# EAGLE design SparkFun_Mega_Pro_Mini-3.3V (EAGLE 7.2.0)
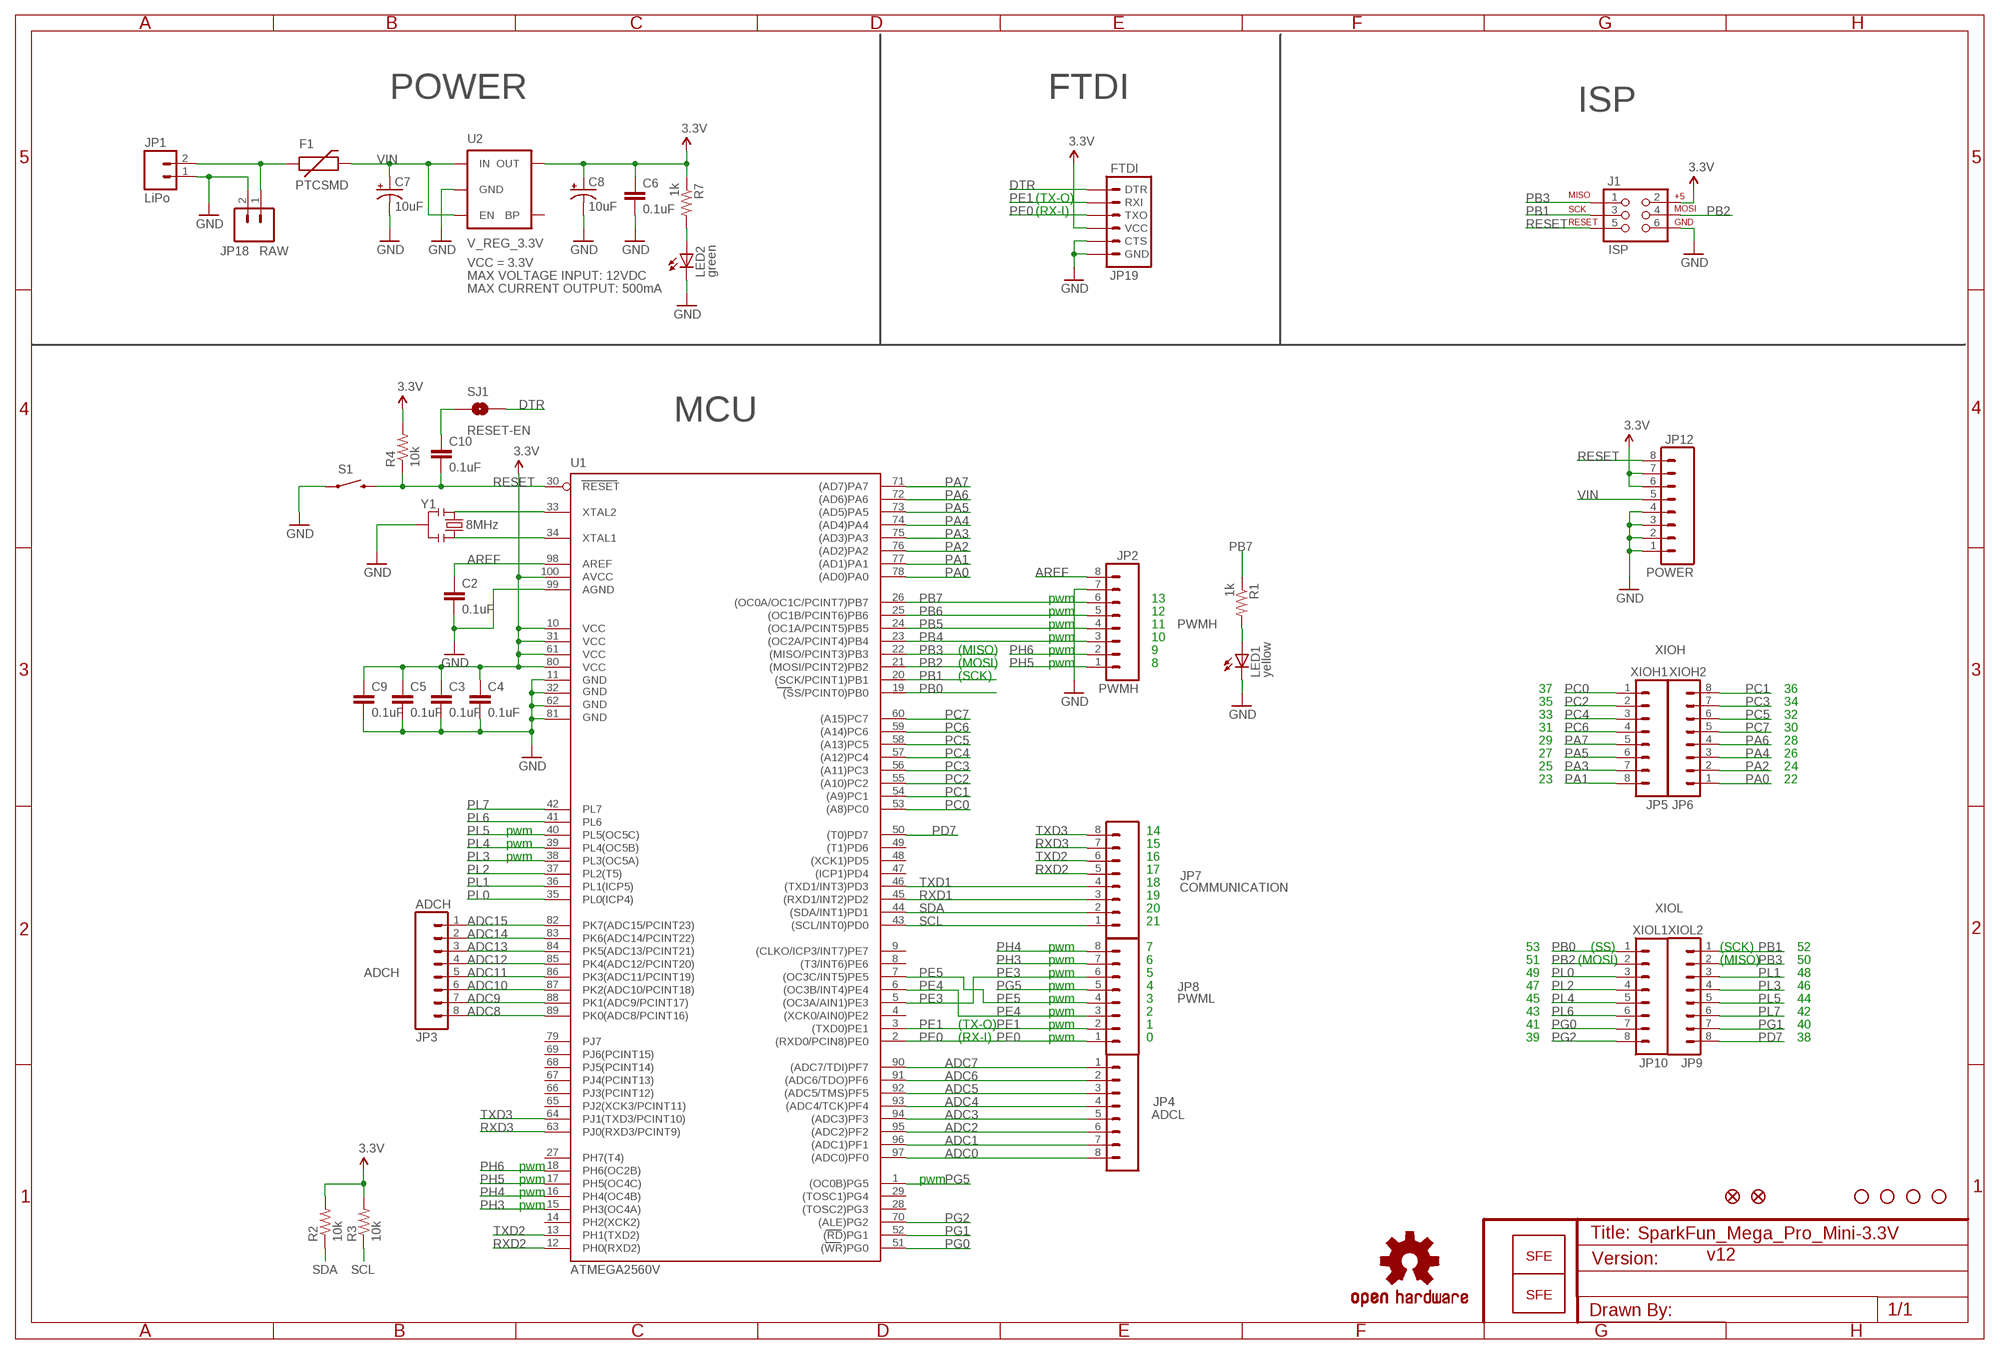
[diagram p0: schematic, sheet 1]

## Parts
C2  0.1uF  CAP0402-CAP  [0402-CAP]
C3  0.1uF  CAP0402-CAP  [0402-CAP]
C4  0.1uF  CAP0402-CAP  [0402-CAP]
C5  0.1uF  CAP0402-CAP  [0402-CAP]
C6  0.1uF  CAP0402-CAP  [0402-CAP]
C7  10uF  CAP_POL1206  [EIA3216]
C8  10uF  CAP_POL1206  [EIA3216]
C9  0.1uF  CAP0402-CAP  [0402-CAP]
C10  0.1uF  CAP0402-CAP  [0402-CAP]
F1  PTCSMD  [PTC-1206]
J1  ISP  AVR_SPI_PRG_6PTH  [2X3]
JP1  LiPo  M02-JST-2MM-SMT  [JST-2-SMD]
JP2  PWMH  M08BM08B-SRSS-TB  [BM08B-SRSS-TB]
JP3  ADCH  M08BM08B-SRSS-TB  [BM08B-SRSS-TB]
JP4  ADCL  M08BM08B-SRSS-TB  [BM08B-SRSS-TB]
JP5  XIOH1  M08BM08B-SRSS-TB  [BM08B-SRSS-TB]
JP6  XIOH2  M08BM08B-SRSS-TB  [BM08B-SRSS-TB]
JP7  COMM  M08BM08B-SRSS-TB  [BM08B-SRSS-TB]
JP8  PWML  M08BM08B-SRSS-TB  [BM08B-SRSS-TB]
JP9  XIOL2  M08BM08B-SRSS-TB  [BM08B-SRSS-TB]
JP10  XIOL1  M08BM08B-SRSS-TB  [BM08B-SRSS-TB]
JP11  STAND-OFF  [STAND-OFF]
JP12  POWER  M08BM08B-SRSS-TB  [BM08B-SRSS-TB]
JP13  STAND-OFF  [STAND-OFF]
JP14  STAND-OFF  [STAND-OFF]
JP15  STAND-OFF  [STAND-OFF]
JP16  LOGO-SFENEW  [SFE-NEW-WEBLOGO]
JP17  LOGO-SFESK  [SFE-LOGO-FLAME]
JP18  RAW  M02PTH  [1X02]
JP19  FTDI  ARDUINO_SERIAL_PROGRAMSMD  [1X06-SMD]
JP20  FIDUCIAL1X2.5  [FIDUCIAL-1X2.5]
JP21  FIDUCIAL1X2.5  [FIDUCIAL-1X2.5]
LED1  yellow  LED0603  [LED-0603]
LED2  green  LED0603  [LED-0603]
R1  1k  RESISTOR0402-RES  [0402-RES]
R2  10k  RESISTOR0402-RES  [0402-RES]
R3  10k  RESISTOR0402-RES  [0402-RES]
R4  10k  RESISTOR0402-RES  [0402-RES]
R7  1k  RESISTOR0402-RES  [0402-RES]
S1  SWITCH-MOMENTARY-2SMD  [TACTILE_SWITCH_SMD]
SJ1  RESET-EN  SOLDERJUMPERNC  [SJ_2S]
U1  ATMEGA2560AU  [TQFP100]
U2  V_REG_3.3V  V_REG_LDOSMD  [SOT23-5]
U$9  OSHW-LOGOL  [OSHW-LOGO-L]
Y1  RESONATORSMD  [RESONATOR-SMD]

## Nets
3.3V: C3.1 C4.1 C5.1 C6.1 C8.A(+) C9.1 J1.2 JP12.6 JP12.7 JP19.4(VCC) R2.2 R3.2 R4.2 R7.1 U1.10(VCC) U1.31(VCC1) U1.61(VCC2) U1.80(VCC3) U1.100(AVCC) U2.5(OUT)
ADC0: JP4.8 U1.97((ADC0)PF0)
ADC1: JP4.7 U1.96((ADC1)PF1)
ADC2: JP4.6 U1.95((ADC2)PF2)
ADC3: JP4.5 U1.94((ADC3)PF3)
ADC4: JP4.4 U1.93((ADC4/TCK)PF4)
ADC5: JP4.3 U1.92((ADC5/TMS)PF5)
ADC6: JP4.2 U1.91((ADC6/TDO)PF6)
ADC7: JP4.1 U1.90((ADC7/TDI)PF7)
ADC8: JP3.8 U1.89(PK0(ADC8/PCINT16))
ADC9: JP3.7 U1.88(PK1(ADC9/PCINT17))
ADC10: JP3.6 U1.87(PK2(ADC10/PCINT18))
ADC11: JP3.5 U1.86(PK3(ADC11/PCINT19))
ADC12: JP3.4 U1.85(PK4(ADC12/PCINT20))
ADC13: JP3.3 U1.84(PK5(ADC13/PCINT21))
ADC14: JP3.2 U1.83(PK6(ADC14/PCINT22))
ADC15: JP3.1 U1.82(PK7(ADC15/PCINT23))
AREF: C2.1 JP2.8 U1.98(AREF)
DTR: JP19.1(DTR) SJ1.2
GND: C2.2 C3.2 C4.2 C5.2 C6.2 C7.C(-) C8.C(-) C9.2 J1.6 JP1.1 JP2.7 JP12.1 JP12.2 JP12.3 JP12.4 JP18.2 JP19.5(CTS) JP19.6(GND) LED1.C LED2.C S1.1 U1.11(GND) U1.32(GND1) U1.62(GND2) U1.81(GND3) U1.99(AGND) U2.2(GND) Y1.2
N$1: F1.1 JP1.2 JP18.1
N$2: LED1.A R1.2
N$4: LED2.A R7.2
N$5: U1.34(XTAL1) Y1.3
N$6: U1.33(XTAL2) Y1.1
N$7: C10.1 SJ1.1
PA0: JP6.1 U1.78((AD0)PA0)
PA1: JP5.8 U1.77((AD1)PA1)
PA2: JP6.2 U1.76((AD2)PA2)
PA3: JP5.7 U1.75((AD3)PA3)
PA4: JP6.3 U1.74((AD4)PA4)
PA5: JP5.6 U1.73((AD5)PA5)
PA6: JP6.4 U1.72((AD6)PA6)
PA7: JP5.5 U1.71((AD7)PA7)
PB0: JP10.1 U1.19((SS/PCINT0)PB0)
PB1: J1.3 JP9.1 U1.20((SCK/PCINT1)PB1)
PB2: J1.4 JP10.2 U1.21((MOSI/PCINT2)PB2)
PB3: J1.1 JP9.2 U1.22((MISO/PCINT3)PB3)
PB4: JP2.3 U1.23((OC2A/PCINT4)PB4)
PB5: JP2.4 U1.24((OC1A/PCINT5)PB5)
PB6: JP2.5 U1.25((OC1B/PCINT6)PB6)
PB7: JP2.6 R1.1 U1.26((OC0A/OC1C/PCINT7)PB7)
PC0: JP5.1 U1.53((A8)PC0)
PC1: JP6.8 U1.54((A9)PC1)
PC2: JP5.2 U1.55((A10)PC2)
PC3: JP6.7 U1.56((A11)PC3)
PC4: JP5.3 U1.57((A12)PC4)
PC5: JP6.6 U1.58((A13)PC5)
PC6: JP5.4 U1.59((A14)PC6)
PC7: JP6.5 U1.60((A15)PC7)
PD7: JP9.8 U1.50((T0)PD7)
PE0: JP8.1 JP19.3(TXO) U1.2((RXD0/PCIN8)PE0)
PE1: JP8.2 JP19.2(RXI) U1.3((TXD0)PE1)
PE3: JP8.6 U1.5((OC3A/AIN1)PE3)
PE4: JP8.3 U1.6((OC3B/INT4)PE4)
PE5: JP8.4 U1.7((OC3C/INT5)PE5)
PG0: JP10.7 U1.51((WR)PG0)
PG1: JP9.7 U1.52((RD)PG1)
PG2: JP10.8 U1.70((ALE)PG2)
PG5: JP8.5 U1.1((OC0B)PG5)
PH3: JP8.7 U1.15(PH3(OC4A))
PH4: JP8.8 U1.16(PH4(OC4B))
PH5: JP2.1 U1.17(PH5(OC4C))
PH6: JP2.2 U1.18(PH6(OC2B))
PL0: JP10.3 U1.35(PL0(ICP4))
PL1: JP9.3 U1.36(PL1(ICP5))
PL2: JP10.4 U1.37(PL2(T5))
PL3: JP9.4 U1.38(PL3(OC5A))
PL4: JP10.5 U1.39(PL4(OC5B))
PL5: JP9.5 U1.40(PL5(OC5C))
PL6: JP10.6 U1.41(PL6)
PL7: JP9.6 U1.42(PL7)
RESET: C10.2 J1.5 JP12.8 R4.1 S1.3 U1.30(RESET)
RXD1: JP7.3 U1.45((RXD1/INT2)PD2)
RXD2: JP7.5 U1.12(PH0(RXD2))
RXD3: JP7.7 U1.63(PJ0(RXD3/PCINT9))
SCL: JP7.1 R3.1 U1.43((SCL/INT0)PD0)
SDA: JP7.2 R2.1 U1.44((SDA/INT1)PD1)
TXD1: JP7.4 U1.46((TXD1/INT3)PD3)
TXD2: JP7.6 U1.13(PH1(TXD2))
TXD3: JP7.8 U1.64(PJ1(TXD3/PCINT10))
VIN: C7.A(+) F1.2 JP12.5 U2.1(IN) U2.3(EN)
Unconnected: U1.4((XCK0/AIN0)PE2) U1.8((T3/INT6)PE6) U1.9((CLKO/ICP3/INT7)PE7) U1.14(PH2(XCK2)) U1.27(PH7(T4)) U1.28((TOSC2)PG3) U1.29((TOSC1)PG4) U1.47((ICP1)PD4) U1.48((XCK1)PD5) U1.49((T1)PD6) U1.65(PJ2(XCK3/PCINT11)) U1.66(PJ3(PCINT12)) U1.67(PJ4(PCINT13)) U1.68(PJ5(PCINT14)) U1.69(PJ6(PCINT15)) U1.79(PJ7) U2.4(BP)

## Notes on the sheet
- POWER | FTDI
- ISP
- (TX-O)
- (RX-I)
- VCC = 3.3V
- MAX VOLTAGE INPUT: 12VDC
- MAX CURRENT OUTPUT: 500mA
- MCU
- 8MHz
- pwm | 13
- pwm | 12
- pwm | 11 | PWMH
- pwm | 10
- (MISO) | pwm | 9 | XIOH
- (MOSI) | pwm | 8
- (SCK)
- 37 | 36
- 35 | 34
- 33 | 32
- 31 | 30
- 29 | 28
- 27 | 26
- 25 | 24
- 23 | 22
- pwm | 14
- pwm | 15
- pwm | 16
- 17
- 18
- COMMUNICATION
- 19
- 20 | XIOL
- 21
- pwm | 7 | 53 | (SS) | (SCK) | 52
- pwm | 6 | 51 | (MOSI) | (MISO) | 50
- ADCH | pwm | 5 | 49 | 48
- pwm | 4 | 47 | 46
- pwm | 3 | PWML | 45 | 44
- pwm | 2 | 43 | 42
- (TX-O) | pwm | 1 | 41 | 40
- (RX-I) | pwm | 0 | 39 | 38
- pwm
- pwm | pwm
- pwm
- pwm
- v12
- ATMEGA2560V

## Library data of the parts
C2-C6 C9 C10 = SparkFun:CAP: Capacitor Standard 0603 ceramic capacitor, and 0.1" leaded capacitor.
C7 C8 = SparkFun:CAP_POL: Capacitor Polarized These are standard SMD and PTH capacitors. Normally 10uF, 47uF, and 100uF in electrolytic and tantalum varieties. Always verify the external diameter of the through hole cap, it varies with capacity, voltage, and manufacturer. The EIA devices should be standard.
F1 = SparkFun:PTC: Resettable Fuse PTC Resettable Fuse. Spark Fun Electronics SKU : COM-08357
J1 = SparkFun:AVR_SPI_PRG_6: AVR ISP 6 Pin This is the reduced ISP connector for AVR programming. Common on Arduino. This footprint will take up less PCB space and can be used with a 10-pin to 6-pin adapter such as SKU: BOB-08508
JP1 JP18 = SparkFun:M02: Header 2 Standard 2-pin 0.1" header. Use with straight break away headers (SKU : PRT-00116), right angle break away headers (PRT-00553), swiss pins (PRT-00743), machine pins (PRT-00117), and female headers (PRT-00115). Molex polarized connector foot print use with SKU : PRT-08233 with associated crimp pins and housings.
JP2-JP10 JP12 = SparkFun:M08: Header 8 Standard 8-pin 0.1" header. Use with straight break away headers (SKU : PRT-00116), right angle break away headers (PRT-00553), swiss pins (PRT-00743), machine pins (PRT-00117), and female headers (PRT-00115).
JP11 JP13-JP15 = SparkFun:STAND-OFF: Stand Off This is the mechanical footprint for a #4 phillips button head screw. Use the keepout ring to avoid running the screw head into surrounding components. SKU : PRT-00447
JP16 JP17 = SparkFun:LOGO-SFE: Spark Fun Electronics PCB Logo This is the standard Spark Fun Electronics PCB logo.
JP19 = SparkFun:ARDUINO_SERIAL_PROGRAM
JP20 JP21 = abes:FIDUCIAL: Fiducial Alignment Points Various fiducial points for machine vision alignment.
LED1 LED2 = SparkFun:LED: LEDs Standard schematic elements and footprints for 5mm, 3mm, 1206, and 0603 sized LEDs. 5mm - Spark Fun Electronics SKU : COM-00529 (and others)
R1-R4 R7 = SparkFun:RESISTOR: Resistor Basic schematic elements and footprints for 0603, 1206, and PTH resistors.
S1 = SparkFun:SWITCH-MOMENTARY-2
SJ1 = SparkFun:SOLDERJUMPER: Solder Jumper Standard SMD solder jumper. Used to automate production. Two varients : Normally Open and Normally Closed are the same, but have different paste layers. NC will have a large amount of paste and should jumper during reflow.
U1 = SparkFun:ATMEGA2560: MICROCONTROLLER 64/128/256 Kbytes FLASH 4 Kbytes EEPROM 8 Kbytes SRAM 86 General Purpose I/O pins 12-channels16-bit PWM 4 x Serial USARTs 16-channels 10-bit A/D
U2 = SparkFun:V_REG_LDO: Voltage Regulator LDO Standard 150mA LDO voltage regulator in SOT-23 layout. Micrel part MIC5205. BP (by-pass) pin is used to lower output noise with 470pF cap.
U$9 = SparkFun:OSHW-LOGO: Open Source Hardware Logo This logo indicates the piece of hardware it is found on incorporates a OSHW license and/or adheres to the definition of open source hardware found here: http://freedomdefined.org/OSHW
Y1 = SparkFun:RESONATOR: Resonator Small SMD resonator. This is the itty bitty 10/20MHz resonators with built in caps. CSTCE10M0G55 and CSTCE20M0V53. Footprint has been reviewed closely but hasn't been tested yet.

## Net classes
0 default: width 0.152 mm, drill 0.305 mm, clearance 0.152 mm

## Board
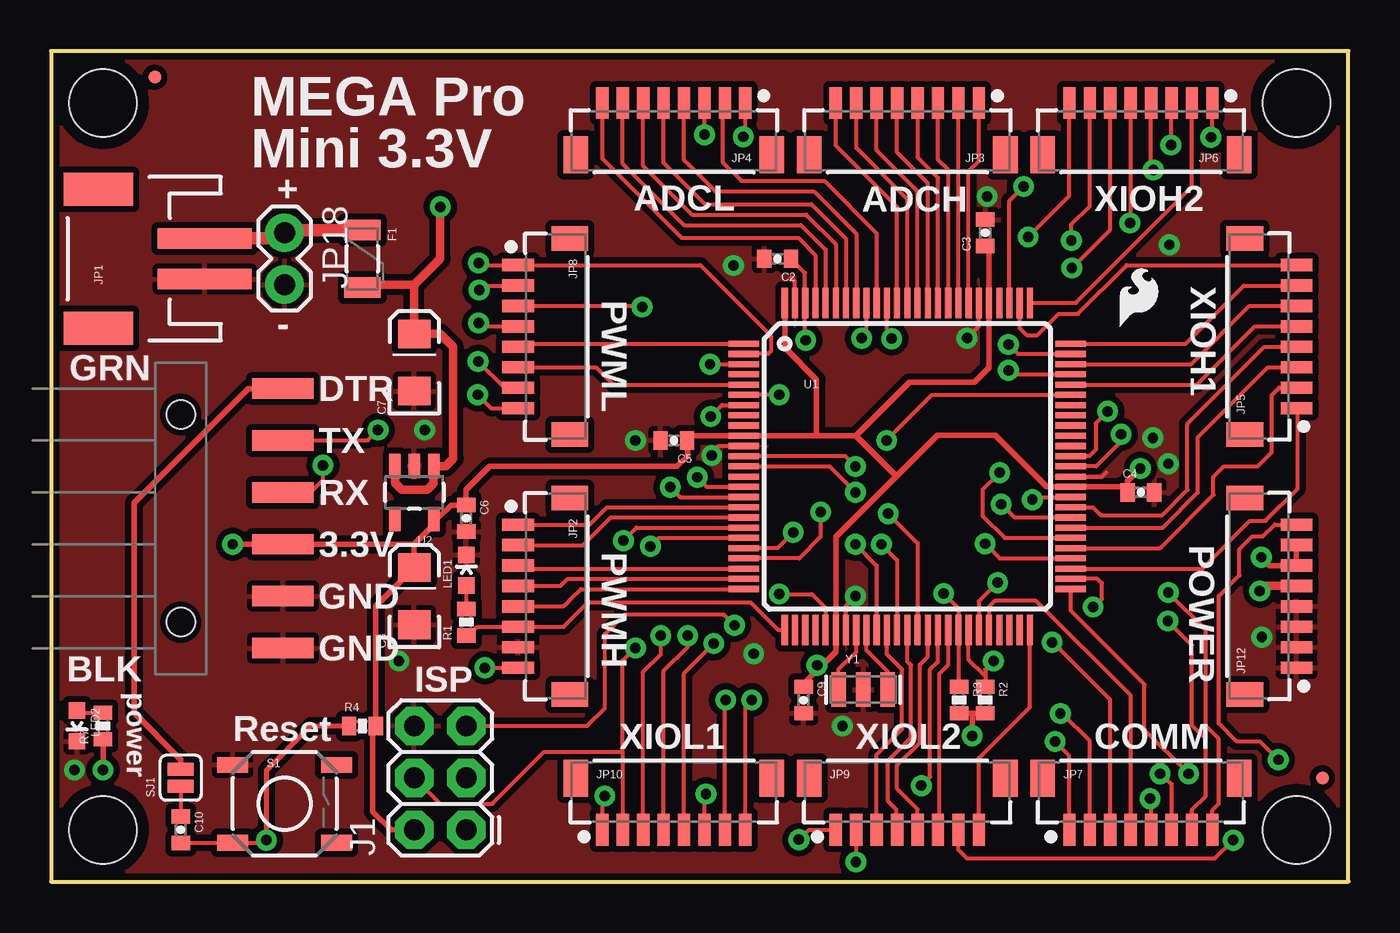
[diagram p1: board, top side]
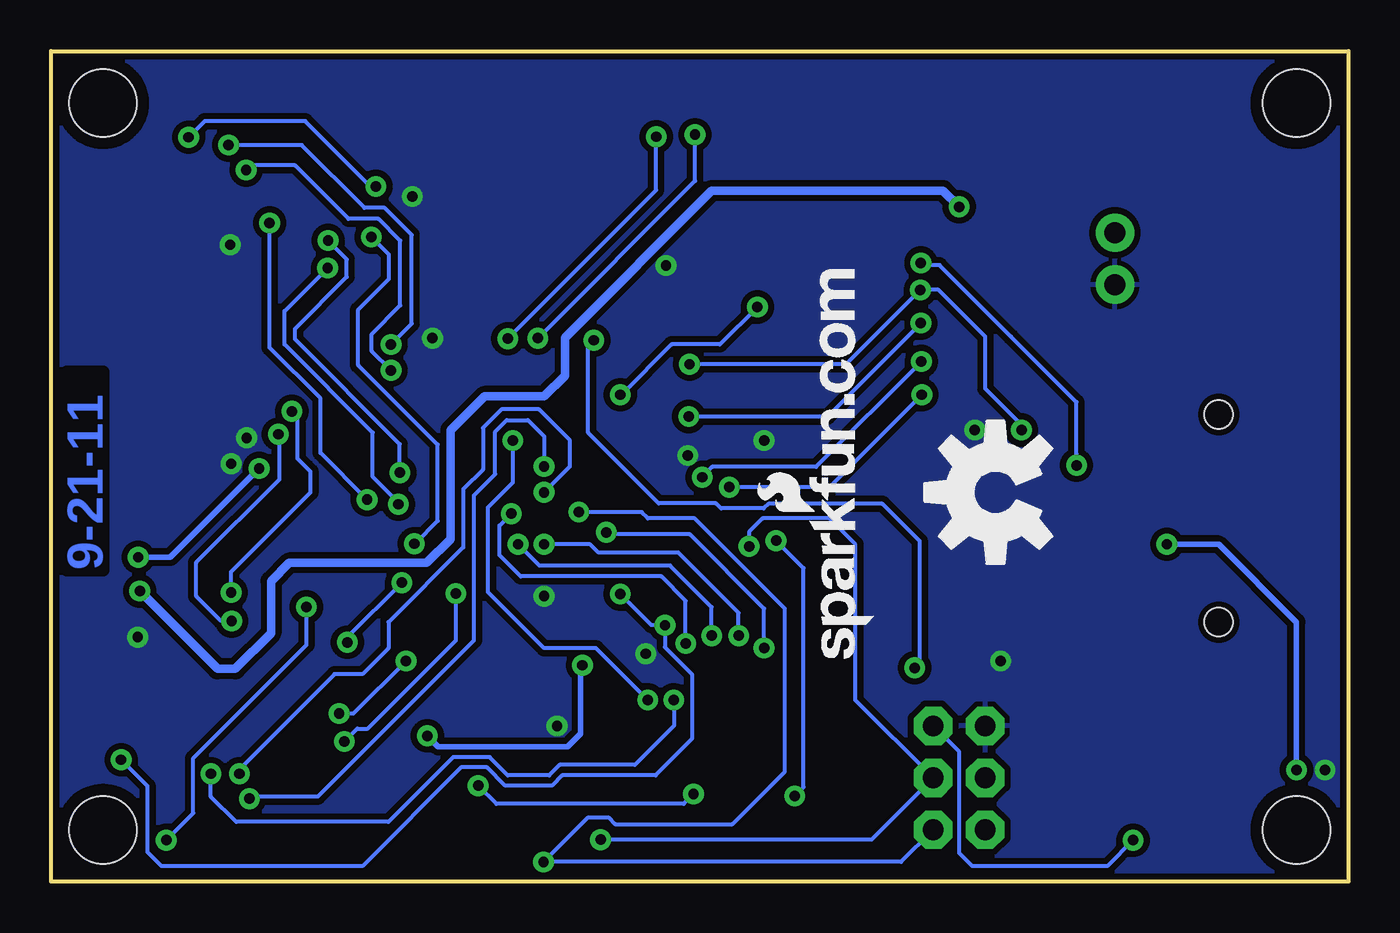
[diagram p2: board, bottom side, seen from below]

Size 63.5 x 40.64 mm. Coordinates in mm from the lower left corner, seen from the top.
Outline: 0,0 63.5,0 63.5,40.64 0,40.64 0,0
Copper layers (1*16): Top 0.035mm / dielectric 1.5mm / Bottom 0.035mm
Design rules "SparkFun": minimum track width 8mil, minimum drill 20mil, track to track 8mil, track to pad 8mil, pad to pad 8mil, via to via 8mil, smd to smd 8mil, copper to edge 8mil, drill to drill 8mil, minimum pad ring 12mil, minimum via ring 10mil, stop-mask expansion 4mil, vias tented up to drill 20mil, thermal gap 10mil

### Footprints (pad centres in the part's own frame; a part is rotated, then mirrored left to right if it is on the bottom)
0402-CAP = smd 0.7 x 0.9: 1 -0.65,0; 2 0.65,0
EIA3216 = smd 1.4 x 1.6: A 1.4,0; C -1.4,0
PTC-1206 = smd 1 x 1.8: 1 -1.4,0; 2 1.4,0
2X3 = drill 1.016 pad 1.88 octagon: 1 0,0; 2 0,2.54; 3 2.54,0; 4 2.54,2.54; 5 5.08,0; 6 5.08,2.54
JST-2-SMD = smd 1 x 4.6: 1 -1,-3.7; 2 1,-3.7 | smd 1.6 x 3.4: NC1 -3.4,1.5; NC2 3.4,1.5
BM08B-SRSS-TB = smd 0.6 x 1.55: 1 -3.5,0; 2 -2.5,0; 3 -1.5,0; 4 -0.5,0; 5 0.5,0; 6 1.5,0; 7 2.5,0; 8 3.5,0 | smd 1.2 x 1.8: P$9 4.8,2.525; P$10 -4.8,2.525
STAND-OFF = hole 3.302: 0,0
1X02 = drill 1.016 pad 1.88: 1 0,0; 2 2.54,0
1X06-SMD = smd 1 x 3: 1 -6.35,5; 2 -3.81,5; 3 -1.27,5; 4 1.27,5; 5 3.81,5; 6 6.35,5 | hole 1.4: -5.08,0; 5.08,0
FIDUCIAL-1X2.5 = smd 0.635 x 0.635: 1 0,0
LED-0603 = smd 0.8 x 0.8: A 0,-0.75; C 0,0.75
0402-RES = smd 0.7 x 0.9: 1 -0.65,0; 2 0.65,0
TACTILE_SWITCH_SMD = smd 1.524 x 0.762: 1 -2.54,1.905; 2 2.54,1.905; 3 -2.54,-1.905; 4 2.54,-1.905
SJ_2S = smd 0.635 x 1.27: 1 -0.412,0; 2 0.412,0
TQFP100 = smd 1.5 x 0.3: 1 -8,6; 2 -8,5.5; 3 -8,5; 4 -8,4.5; 5 -8,4; 6 -8,3.5; 7 -8,3; 8 -8,2.5; 9 -8,2; 10 -8,1.5; 11 -8,1; 12 -8,0.5; 13 -8,0; 14 -8,-0.5; 15 -8,-1; 16 -8,-1.5; 17 -8,-2; 18 -8,-2.5; 19 -8,-3; 20 -8,-3.5; 21 -8,-4; 22 -8,-4.5; 23 -8,-5; 24 -8,-5.5; 25 -8,-6; 51 8,-6; 52 8,-5.5; 53 8,-5; 54 8,-4.5; 55 8,-4; 56 8,-3.5; 57 8,-3; 58 8,-2.5; 59 8,-2; 60 8,-1.5; 61 8,-1; 62 8,-0.5; 63 8,0; 64 8,0.5; 65 8,1; 66 8,1.5; 67 8,2; 68 8,2.5; 69 8,3; 70 8,3.5; 71 8,4; 72 8,4.5; 73 8,5; 74 8,5.5; 75 8,6 | smd 0.3 x 1.5: 26 -6,-8; 27 -5.5,-8; 28 -5,-8; 29 -4.5,-8; 30 -4,-8; 31 -3.5,-8; 32 -3,-8; 33 -2.5,-8; 34 -2,-8; 35 -1.5,-8; 36 -1,-8; 37 -0.5,-8; 38 0,-8; 39 0.5,-8; 40 1,-8; 41 1.5,-8; 42 2,-8; 43 2.5,-8; 44 3,-8; 45 3.5,-8; 46 4,-8; 47 4.5,-8; 48 5,-8; 49 5.5,-8; 50 6,-8; 76 6,8; 77 5.5,8; 78 5,8; 79 4.5,8; 80 4,8; 81 3.5,8; 82 3,8; 83 2.5,8; 84 2,8; 85 1.5,8; 86 1,8; 87 0.5,8; 88 0,8; 89 -0.5,8; 90 -1,8; 91 -1.5,8; 92 -2,8; 93 -2.5,8; 94 -3,8; 95 -3.5,8; 96 -4,8; 97 -4.5,8; 98 -5,8; 99 -5.5,8; 100 -6,8
SOT23-5 = smd 0.55 x 1.2: 1 -0.95,-1.3; 2 0,-1.3; 3 0.95,-1.3; 4 0.95,1.3; 5 -0.95,1.3
RESONATOR-SMD = smd 0.7 x 1.7: 1 -1.2,0; 2 0,0; 3 1.2,0

### Placement (x,y rotation side)
C2  35.56,30.48 180 top
C3  45.72,31.75 90 top
C4  53.34,19.05 0 top
C5  30.48,21.59 180 top
C6  20.32,17.78 270 top
C7  17.78,25.4 90 top
C8  17.78,13.97 90 top
C9  36.83,8.89 270 top
C10  6.35,2.54 270 top
F1  15.24,30.48 270 top
J1  20.32,2.54 90 top
JP1  3.81,30.48 90 top
JP2  22.86,13.97 270 top
JP3  41.91,38.1 180 top
JP4  30.48,38.1 180 top
JP5  60.96,26.67 90 top
JP6  53.34,38.1 180 top
JP7  53.34,2.54 0 top
JP8  22.86,26.67 270 top
JP9  41.91,2.54 0 top
JP10  30.48,2.54 0 top
JP11  2.54,2.54 0 top
JP12  60.96,13.97 90 top
JP13  60.96,2.54 0 top
JP14  2.54,38.1 0 top
JP15  60.96,38.1 0 top
JP16  23.24,10.92 90 bottom
JP17  52.32,27.18 0 top
JP18  11.43,31.75 270 top
JP19  6.35,17.78 270 top
JP20  5.08,39.37 0 top
JP21  62.23,5.08 0 top
LED1  20.32,15.24 0 top
LED2  1.27,7.62 180 top
R1  20.32,12.7 90 top
R2  45.72,8.89 270 top
R3  44.45,8.89 270 top
R4  15.24,7.62 0 top
R7  2.54,7.62 90 top
S1  11.43,3.81 0 top
SJ1  6.35,5.08 90 top
U1  41.91,20.32 0 top
U2  17.78,19.05 180 top
U$9  17.27,19.05 90 bottom
Y1  39.75,9.4 0 top

### Tracks (layer width: path | path; a pad name or v marks a point on that pad's centre or on a via)
3.3V  (via drill 0.51)
  Top 0.203: R4.2 15.88,7.63 | 45.91,30.91 C3.1 | C5.1 | 37.57,21.82 37.47,21.92 | 36.83,9.68 C9.1 | 52.42,19.32 C4.1
  Top 0.279: JP12.7 JP12.6 59.64,15.47 v59.23,15.88 | 45.91,30.91 U1.80 45.91,25.16 45.19,24.43 42.01,24.43 39.39,21.82 | C5.1 31.14,20.83 30.63,20.32 21.46,20.32 20.32,19.18 C6.1 19.57,18.43 18.89,17.75 U2.5 18.73,17.46 17.78,16.51 | C5.1 31.36,21.82 U1.10 37.57,21.82 39.39,21.82 | U1.100 35.91,26.12 37.47,24.56 37.47,21.92 | 37.77,10.62 36.83,9.68 | 52.42,19.32 U1.61 48.75,19.32 46.23,21.84 43.38,21.84 41.38,19.84 | 37.77,10.62 v37.49,10.59 | 37.77,10.62 38.41,11.26 U1.31 38.41,16.87 41.38,19.84 | 39.39,21.82 41.38,19.84 | C4.1 52.69,19.59 v53.31,20.22 | v45.09,7.14 45.09,8.24 | 17.78,16.51 C8.A 15.89,13.48 R4.2 15.75,7.48 15.75,3.43 16.64,2.54 J1.2 | 17.78,16.51 JP19.4 v8.89,16.51 | 45.09,8.24 R3.2 | 45.09,8.24 R2.2 | R7.1 v2.54,5.46
  Bottom 0.203: v37.49,10.59 37.59,10.49
  Bottom 0.279: v45.09,7.14 44.55,6.6 38.23,6.6 37.59,7.24 37.59,10.49 | v59.23,15.88 57.66,15.88 v53.31,20.22 | v8.89,16.51 6.35,16.51 2.54,12.7 v2.54,5.46
ADC0
  Top 0.203: U1.97 37.41,30.66 36.58,31.5 30.86,31.5 26.98,35.38 JP4.8
ADC1
  Top 0.203: U1.96 37.91,30.92 36.7,32.13 30.99,32.13 27.98,35.14 JP4.7
ADC2
  Top 0.203: U1.95 38.41,31.19 36.96,32.64 31.37,32.64 28.98,35.03 JP4.6
ADC3
  Top 0.203: U1.94 38.91,31.45 37.21,33.15 32,33.15 29.97,35.18 JP4.5
ADC4
  Top 0.203: U1.93 39.41,31.71 37.34,33.78 32.51,33.78 31.24,35.05 30.99,35.31 30.98,35.31 JP4.4
ADC5  (via drill 0.51)
  Top 0.203: JP4.3 v31.98,36.55 31.93,36.5 | U1.92 39.91,26.83 v39.67,26.59
  Bottom 0.203: v31.98,36.55 31.98,34.29 v39.67,26.59
ADC6
  Top 0.203: U1.91 40.41,31.73 37.85,34.29 33.78,34.29 32.89,35.18 32.89,38.01 JP4.2
ADC7  (via drill 0.51)
  Top 0.203: JP4.1 33.98,36.55 v33.88,36.45 | U1.90 40.91,26.81 v41.15,26.57
  Bottom 0.203: v33.88,36.45 33.88,33.83 v41.15,26.57
ADC8
  Top 0.203: U1.89 41.41,33.01 38.41,36.01 JP3.8
ADC9
  Top 0.203: U1.88 41.91,33.4 39.41,35.9 JP3.7
ADC10
  Top 0.203: U1.87 42.41,33.79 40.41,35.79 JP3.6
ADC11
  Top 0.203: U1.86 42.91,34.18 41.41,35.68 JP3.5
ADC12
  Top 0.203: U1.85 43.41,34.44 42.42,35.43 JP3.4
ADC13
  Top 0.203: U1.84 43.91,34.83 43.41,35.33 JP3.3
ADC14
  Top 0.203: U1.83 JP3.2
ADC15
  Top 0.203: U1.82 44.91,34.75 45.41,35.25 JP3.1
AREF  (via drill 0.51)
  Top 0.203: JP2.8 20.99,10.47 v21.23,10.46 | C2.1 36.91,29.78 U1.98 36.91,26.51 v36.93,26.49
  Bottom 0.203: v21.23,10.46 20.99,10.47 20.99,16.67 22.81,18.49 28.4,18.49 28.63,18.26 30.71,18.26 30.96,18.52 33.76,18.52 37.21,21.97 37.21,26.16 36.93,26.44 v36.93,26.49
DTR
  Top 0.279: JP19.1 9.65,24.13 4.06,18.54 4.06,8.26 6.35,5.97 SJ1.2
GND  (via drill 0.51)
  Top 0.203: U1.32 38.91,13.51 v39.37,13.97 | U1.99 36.41,29.38 36.22,29.57 | U1.11 32.67,21.32 32.44,21.08 | U1.81 45.41,27.17 v44.83,26.59 | U1.62 51.44,19.82 51.64,20.02
  other vias: 28.6,21.59 32.33,20.85 45.82,33.53 38.73,7.62 54.69,20.45 59.26,11.96 34.39,11.15 33.4,30.15 53.92,21.72 54.74,31.17 18.29,22.1 17.02,10.79 1.14,5.46
  pour Bottom (isolate 0.305): 0,0 0,40.64 63.5,40.64 63.5,0
  pour Top (isolate 0.305): 0,40.64 0,0 63.5,0 63.5,40.64
N$1
  Top 0.61: JP1.2 11.16,31.48 JP18.1 11.56,31.88 F1.1
N$2
  Top 0.203: LED1.A R1.2
N$4
  Top 0.203: R7.2 1.37,8.27 LED2.A
N$5
  Top 0.203: Y1.3 40.95,10.28 39.91,11.32 U1.34
N$6
  Top 0.203: Y1.1 38.55,10.38 39.41,11.24 U1.33
N$7
  Top 0.203: SJ1.1 C10.1
PA0  (via drill 0.51)
  Top 0.203: U1.78 46.91,33.32 v47.6,34.01 | JP6.1 56.84,36.49 v56.77,36.42
  Bottom 0.203: v47.6,34.01 47.85,34.01 51.05,37.21 55.98,37.21 v56.77,36.42
PA1
  Top 0.203: JP5.8 52.65,30.17 50.27,27.79 49.33,27.79 48.28,26.75 47.75,26.75 47.41,27.09 U1.77
PA2
  Top 0.203: U1.76 50.16,28.32 55.84,34 JP6.2
PA3
  Top 0.203: U1.75 55.53,26.32 58.38,29.17 JP5.7
PA4  (via drill 0.51)
  Top 0.203: JP6.3 54.84,36.07 v54.81,36.04 | U1.74 47.33,25.82 v46.86,26.29
  Bottom 0.203: v54.81,36.04 51.23,36.04 48.16,32.97 47.17,32.97 45.85,31.65 45.85,27.3 v46.86,26.29
PA5
  Top 0.203: U1.73 55.8,25.32 58.65,28.17 JP5.6
PA6  (via drill 0.51)
  Top 0.203: U1.72 47.06,24.82 v46.86,25.02 | JP6.4 53.84,34.93 v53.95,34.82
  Bottom 0.203: v46.86,25.02 47.8,25.96 47.8,26.8 46.41,28.19 46.41,31.37 47.47,32.44 48.95,32.44 51.56,35.05 53.72,35.05 v53.95,34.82
PA7
  Top 0.203: U1.71 56.07,24.32 58.92,27.17 JP5.5
PB0  (via drill 0.51)
  Top 0.203: JP10.1 26.98,4.07 v27.1,4.19 | U1.19 28.65,17.32 v28.02,16.69
  Bottom 0.203: v27.1,4.19 26.67,4.62 26.67,15.34 v28.02,16.69
PB1  (via drill 0.51)
  Top 0.203: JP9.1 37.08,2.54 v36.6,2.06 | U1.20 29.75,16.82 v29.34,16.41
  Bottom 0.203: v36.6,2.06 23.34,2.06 J1.3 24.13,8.89 24.13,16.51 25.4,17.78 28.68,17.78 29.34,17.12 v29.34,16.41
PB2  (via drill 0.51)
  Top 0.203: J1.4 19.05,3.81 21.59,3.81 24.13,6.35 27.98,6.35 | U1.21 35.55,16.32 v36.32,17.09 36.32,17.07 | 27.98,6.35 JP10.2 | 27.98,6.35 27.98,10.81 v28.6,11.43
  Bottom 0.203: v28.6,11.43 28.6,13.36 32.23,16.99 36.22,16.99 v36.32,17.09
PB3  (via drill 0.51)
  Top 0.203: U1.22 36.62,15.82 37.67,16.87 v37.67,18.09 | JP9.2 v39.41,0.98 v39.4,0.96
  Bottom 0.203: J1.1 21.89,0.96 v39.4,0.96 37.21,3.15 36.22,3.15 35.89,2.82 30.15,2.82 27.58,5.38 27.58,13.36 32,17.78 34.29,17.78 34.59,18.09 v37.67,18.09
PB4
  Top 0.203: U1.23 23.01,15.32 JP2.3
PB5
  Top 0.203: U1.24 25.29,14.82 24.93,14.47 JP2.4
PB6
  Top 0.203: U1.25 25.93,14.32 25.49,13.88 25.15,13.54 25.08,13.47 JP2.5
PB7
  Top 0.203: R1.1 20.43,12.05 20.85,12.47 JP2.6 25.09,12.47 26.29,13.66 34.24,13.66 35.58,12.32 U1.26
PC0
  Top 0.203: JP5.1 61.01,23.12 61.01,19.23 59.44,17.65 58.67,17.65 56.34,15.32 U1.53
PC1  (via drill 0.51)
  Top 0.203: JP6.8 49.84,33.56 v47.83,31.55 | U1.54 46.44,15.82 v45.72,16.54
  Bottom 0.203: v47.83,31.55 46.97,30.68 46.97,29.49 48.46,27.99 48.46,25.27 44.58,21.39 44.58,17.65 45.7,16.54 v45.72,16.54
PC2
  Top 0.203: JP5.2 60.11,24.17 59.74,23.8 59.74,21.01 59.05,20.32 57.4,20.32 56.9,19.81 56.9,18.92 54.29,16.32 U1.55
PC3  (via drill 0.51)
  Top 0.203: JP6.7 50.84,33.06 49.94,32.16 v49.94,31.37 | U1.56 46.68,16.82 45.59,17.91 45.59,19.18 v46.43,20.02
  Bottom 0.203: v46.43,20.02 46.43,21.41 51.56,26.54 51.56,27.05 49.02,29.59 49.02,30.45 v49.94,31.37
PC4
  Top 0.203: JP5.3 59.56,25.17 56.13,21.74 56.13,19.05 54.41,17.32 U1.57
PC5  (via drill 0.51)
  Top 0.203: U1.58 47.15,17.82 v46.51,18.47 | JP6.6 51.84,31.9 v49.96,30.02
  Bottom 0.203: v49.96,30.02 52.07,27.91 52.07,26.29 47.75,21.97 47.75,19.81 46.51,18.57 v46.51,18.47
PC6
  Top 0.203: U1.59 51,18.32 51.38,17.93 54.38,17.93 55.63,19.18 55.63,22.4 59.39,26.17 JP5.4
PC7  (via drill 0.51)
  Top 0.203: U1.60 48.16,18.82 v48.03,18.69 | JP6.5 52.84,32.14 v52.81,32.23
  Bottom 0.203: v52.81,32.23 52.81,26.14 50.32,23.65 50.32,20.98 v48.03,18.69
PD7
  Top 0.203: U1.50 47.91,8.54 45.41,6.04 JP9.8
PE0  (via drill 0.51)
  Top 0.203: U1.2 35.09,25.82 35.23,25.96 35.23,26.72 31.78,30.17 JP8.1 21.04,30.17 v20.93,30.28 | v13.31,20.37 13.31,19.66 12.7,19.05 JP19.3
  Bottom 0.203: v20.93,30.28 20.82,30.17 20.01,30.17 16.51,26.67 13.31,23.47 13.31,20.93 v13.31,20.37
PE1  (via drill 0.51)
  Top 0.203: JP8.2 21.17,29.17 v20.95,28.96 | U1.3 v32.25,25.32 32.23,25.3 | JP19.2 12.7,21.59 15.49,21.59 v16,22.1
  Bottom 0.203: v32.25,25.32 24.59,25.32 v20.95,28.96 | v20.95,28.96 21.29,28.96 | v16,22.1 16,22.35 17.78,24.13 17.78,26.67 20.07,28.96 v20.95,28.96
PE3
  Top 0.203: JP8.6 26.67,25.17 27.52,24.32 U1.5
PE4  (via drill 0.51)
  Top 0.203: U1.6 v35.63,23.82 v35.64,23.82 | JP8.3 28.88,28.17 v28.93,28.12
  Bottom 0.203: v35.64,23.82 35.59,23.82 33.12,26.29 30.76,26.29 v28.93,28.12
PE5  (via drill 0.51)
  Top 0.203: U1.7 32.84,23.32 v32.28,22.76 | JP8.4 21.09,27.17 v20.93,27.33
  Bottom 0.203: v32.28,22.76 25.5,22.76 v20.93,27.33
PG0  (via drill 0.51)
  Top 0.203: JP10.7 32.98,8.85 v33.02,8.89 | U1.51 49.91,13.26 53.52,9.65 53.52,7.44 v55.68,5.28
  Bottom 0.203: v33.02,8.89 33.02,7.62 34.92,5.71 38.61,5.71 39.12,5.21 41.15,5.21 42.04,6.1 43.81,6.1 46.99,2.92 54.43,2.92 55.68,4.17 v55.68,5.28
PG1  (via drill 0.51)
  Top 0.203: JP9.7 44.41,1.56 44.83,1.14 56.97,1.14 v57.86,2.03 | v51,13.44 51.03,13.44 51.44,13.84 51.44,14.61 51.22,14.82 U1.52
  Bottom 0.203: v57.86,2.03 56.54,3.35 56.54,6.04 51,11.58 v51,13.44
PG2  (via drill 0.51)
  Top 0.203: JP10.8 33.98,8.58 v34.29,8.89 | U1.70 43.12,23.82 v40.89,21.59
  Bottom 0.203: v34.29,8.89 36.83,11.43 39.37,11.43 42.11,14.17 42.11,18.31 40.89,19.53 v40.89,21.59
PG5
  Top 0.203: U1.1 23.01,26.32 JP8.5
PH3  (via drill 0.51)
  Top 0.203: U1.15 32.09,19.32 v31.62,19.79 | JP8.7 22.18,24.17 v20.9,25.45
  Bottom 0.203: v31.62,19.79 31.62,19.81 31.14,20.3 26.06,20.3 v20.9,25.45
PH4  (via drill 0.51)
  Top 0.203: U1.16 30.79,18.82 v30.3,19.3 | JP8.8 21.53,23.17 v20.88,23.82
  Bottom 0.203: v30.3,19.3 25.4,19.3 v20.88,23.82
PH5
  Top 0.203: U1.17 27.21,18.32 26.36,17.47 JP2.1
PH6
  Top 0.203: U1.18 27.4,17.82 26.05,16.47 JP2.2
PL0  (via drill 0.51)
  Top 0.203: JP10.3 28.98,10.26 29.84,11.12 v29.84,12.04 | U1.35 40.41,15.47 v39.37,16.51
  Bottom 0.203: v39.37,16.51 37.11,16.51 36.7,16.1 32.79,16.1 29.84,13.16 v29.84,12.04
PL1
  Top 0.203: U1.36 40.91,11.13 41.66,10.39 41.66,7.47 40.41,6.22 JP9.3
PL2  (via drill 0.51)
  Top 0.203: JP10.4 29.98,10.32 31.17,11.51 v31.17,12.04 | U1.37 41.41,15.74 v40.64,16.51
  Bottom 0.203: v31.17,12.04 31.17,13.44 33.2,15.47 39.6,15.47 v40.64,16.51
PL3
  Top 0.203: U1.38 41.91,10.77 42.09,10.59 42.09,7.04 40.97,5.92 40.97,3.94 41.38,3.53 41.38,2.57 JP9.4
PL4  (via drill 0.51)
  Top 0.203: JP10.5 30.98,10.2 v32.44,11.66 | U1.39 42.41,16.57 v40.97,18.01
  Bottom 0.203: v32.44,11.66 32.44,13.74 33.63,14.94 40.51,14.94 41.55,15.98 41.55,17.42 v40.97,18.01 40.97,17.98
PL5
  Top 0.203: U1.40 42.91,11.01 42.52,10.62 42.52,6.81 41.4,5.69 41.4,4.55 42.41,3.54 JP9.5
PL6  (via drill 0.51)
  Top 0.203: U1.41 43.41,10.77 43.03,10.39 43.03,5.13 v42.6,4.7 | JP10.6 31.98,4.22 v32.05,4.29
  Bottom 0.203: v32.05,4.29 32.54,3.81 41.71,3.81 v42.6,4.7
PL7
  Top 0.203: U1.42 43.91,10.87 43.91,10.61 43.48,10.19 43.48,2.62 JP9.6
RESET  (via drill 0.51)
  Top 0.203: v10.54,2.03 10.41,1.91 S1.3 6.37,1.91 C10.2 | J1.5 26.24,7.62 27.1,8.48 27.1,12.12 27.86,12.88 27.89,12.88 28.09,13.08 32.92,13.08 v33.45,12.55 33.12,12.88 | U1.30 37.91,13.4 37.24,14.07 v35.64,14.07 | v60.07,5.97 59.18,6.86 58.04,6.86 57.15,7.75 57.15,13.97 58.17,14.99 58.17,16.26 58.8,16.89 59.31,16.89 59.89,17.47 JP12.8
  Top 0.254: R4.1 12.7,7.62 10.54,5.46 v10.54,2.03
  Bottom 0.203: J1.5 19.05,6.35 19.05,1.4 18.41,0.76 11.81,0.76 v10.54,2.03 | v35.64,14.07 34.11,12.55 v33.45,12.55 33.45,11.48 32.13,10.16 32.13,6.99 33.91,5.21 38.48,5.21 38.99,4.7 41.27,4.7 42.16,5.59 43.43,5.59 48.26,0.76 58.09,0.76 58.78,1.45 58.78,4.67 v60.07,5.97
RXD1  (via drill 0.51)
  Top 0.203: JP7.3 51.84,8.89 49.02,11.71 v49,11.71 | U1.45 45.41,13.71 v46.33,14.63
  Bottom 0.203: v49,11.71 49,11.99 v46.33,14.63
RXD2  (via drill 0.51)
  Top 0.203: U1.12 38.87,20.82 v39.37,20.32 | JP7.5 53.84,4.02 v53.8,4.06
  Bottom 0.203: v39.37,20.32 39.37,21.79 40.16,22.58 41.2,22.58 41.76,22.02 41.76,19.94 42.8,18.9 42.8,11.81 50.44,4.17 53.7,4.17 v53.8,4.06
RXD3  (via drill 0.51)
  Top 0.203: U1.63 51.16,20.32 52.38,21.54 v52.38,21.89 | v54.66,12.75 55.84,11.57 55.84,7.66 56.52,6.99 56.52,4.19 55.84,3.52 JP7.7
  Bottom 0.203: v52.38,21.89 52.32,21.84 52.32,19.68 56.39,15.62 56.39,13.97 55.17,12.75 v54.66,12.75
SCL  (via drill 0.51)
  Top 0.203: R3.1 44.41,9.58 U1.43 44.41,13.38 v43.69,14.1 | JP7.1 49.84,6.17 v49.15,6.86
  Bottom 0.203: v43.69,14.1 43.69,11.81 48.01,7.49 48.51,7.49 v49.15,6.86
SDA  (via drill 0.51)
  Top 0.203: U1.44 44.91,10.87 45.72,10.06 | 45.72,10.06 R2.1 | JP7.2 50.84,6.89 49.55,8.18 49.45,8.18 v49.4,8.23 | 45.72,10.06 45.72,10.39 v46.13,10.79
  Bottom 0.203: v49.4,8.23 48.69,8.23 v46.13,10.79
TXD1
  Top 0.203: JP7.4 52.84,9.11 48.21,13.74 46.2,13.74 45.91,13.45 U1.46
TXD2  (via drill 0.51)
  Top 0.203: U1.13 38.1,20.32 v39.37,19.05 | JP7.6 54.84,4.77 54.33,5.28 v54.28,5.28
  Bottom 0.203: v39.37,19.05 38.1,20.32 38.1,21.59 39.62,23.11 41.45,23.11 42.37,22.2 42.37,20.17 43.33,19.2 43.33,16.36 46.99,12.7 46.99,11.43 48.26,10.16 49.63,10.16 54.28,5.51 v54.28,5.28
TXD3  (via drill 0.51)
  Top 0.203: U1.64 50.82,20.82 51.13,21.13 51.13,22.43 v51.71,23.01 | v54.69,14.15 56.52,12.32 56.52,7.62 57.15,6.99 57.15,3.81 56.84,3.5 JP7.8
  Bottom 0.203: v54.69,14.15 54.69,15.16 50.8,19.05 50.8,20.07 51.44,20.7 51.44,22.73 v51.71,23.01
VIN  (via drill 0.51)
  Top 0.406: JP12.5 59.4,14.47 v59.16,14.22 | v19.05,33.02 19.05,30.48 17.78,29.21 | 17.78,29.21 15.37,29.21 F1.2 | 17.78,29.21 C7.A 19.05,26.8 19.68,26.16 19.68,20.7 19.3,20.32 18.76,20.32 U2.1 18.73,19.49 18.41,19.18 17.14,19.18 16.83,19.49 U2.3
  Bottom 0.406: v59.16,14.22 55.35,10.41 54.48,10.41 52.73,12.17 52.73,14.71 51.84,15.6 45.11,15.6 43.94,16.76 43.94,22.1 42.29,23.75 39.37,23.75 38.35,24.77 38.35,26.62 31.17,33.81 19.84,33.81 v19.05,33.02

### Text on the board
Bottom: 9-21-11
tPlace: MEGA Pro | Mini 3.3V | + | ADCL | ADCH | XIOH2 | XIOH1 | PWML | - | GRN | DTR | TX | RX | 3.3V | PWMH | POWER | GND | GND | BLK | power | ISP | Reset | XIOL1 | XIOL2 | COMM